# Altium schematic sheet Sheet2.SchDoc
size 420 x 297 mm; SheetNumber: 1; SheetTotal: 1
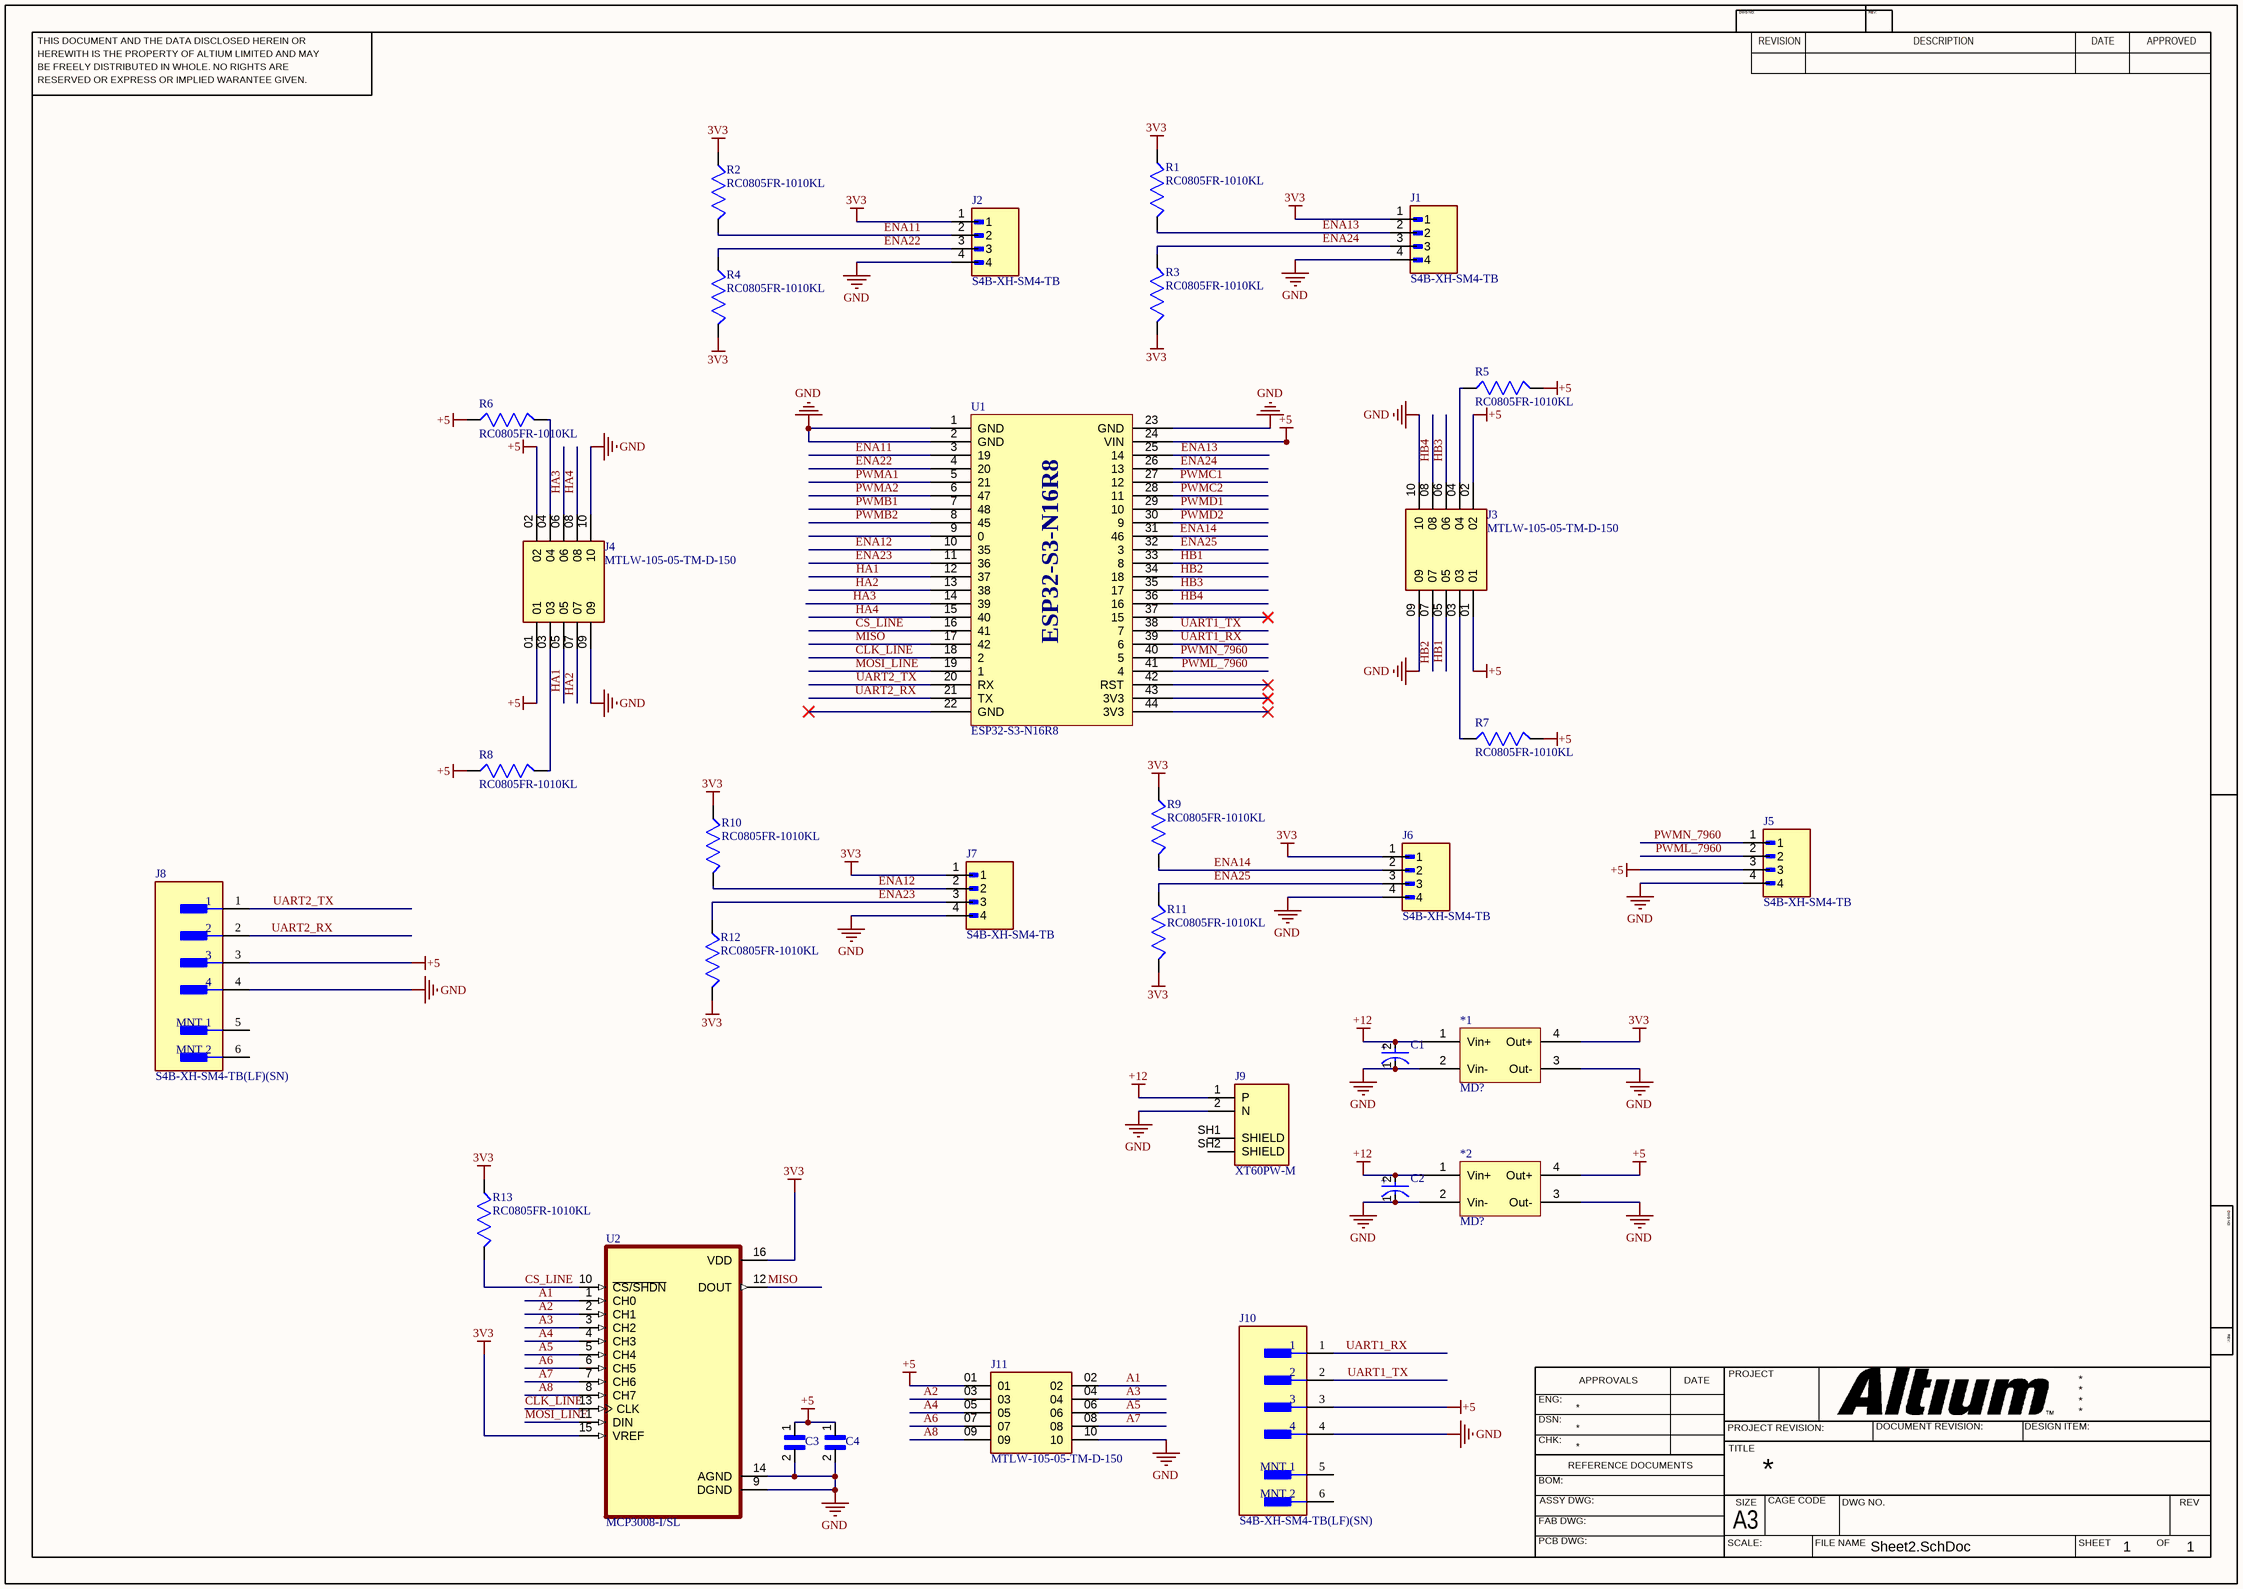
[diagram p0: Sheet2.SchDoc]

## Parts
*1  MD?  [MP1584]
*2  MD?  [MP1584]
C1  100SXV15MX  [FP-OS-CON-SMT-F8-MFG]  (value not drawn)
C2  100SXV15MX  [FP-OS-CON-SMT-F8-MFG]  (value not drawn)
C3  F951C106MPAAQ2  [CAPC2012X140N]  (value not drawn)
C4  F951C106MPAAQ2  [CAPC2012X140N]  (value not drawn)
J1  S4B-XH-SM4-TB  [JST_S4B-XH-SM4-TB]
J2  S4B-XH-SM4-TB  [JST_S4B-XH-SM4-TB]
J3  MTLW-105-05-TM-D-150  [SAMTEC_MTLW-105-05-TM-D-150]
J4  MTLW-105-05-TM-D-150  [SAMTEC_MTLW-105-05-TM-D-150]
J5  S4B-XH-SM4-TB  [JST_S4B-XH-SM4-TB]
J6  S4B-XH-SM4-TB  [JST_S4B-XH-SM4-TB]
J7  S4B-XH-SM4-TB  [JST_S4B-XH-SM4-TB]
J8  S4B-XH-SM4-TB(LF)(SN)  [FP-S4B-XH-SM4-TB_LF_SN-MFG]
J9  XT60PW-M  [AMASS_XT60PW-M]
J10  S4B-XH-SM4-TB(LF)(SN)  [FP-S4B-XH-SM4-TB_LF_SN-MFG]
J11  MTLW-105-05-TM-D-150  [SAMTEC_MTLW-105-05-TM-D-150]
R1  RC0805FR-1010KL  [RESC2012X60N]
R2  RC0805FR-1010KL  [RESC2012X60N]
R3  RC0805FR-1010KL  [RESC2012X60N]
R4  RC0805FR-1010KL  [RESC2012X60N]
R5  RC0805FR-1010KL  [RESC2012X60N]
R6  RC0805FR-1010KL  [RESC2012X60N]
R7  RC0805FR-1010KL  [RESC2012X60N]
R8  RC0805FR-1010KL  [RESC2012X60N]
R9  RC0805FR-1010KL  [RESC2012X60N]
R10  RC0805FR-1010KL  [RESC2012X60N]
R11  RC0805FR-1010KL  [RESC2012X60N]
R12  RC0805FR-1010KL  [RESC2012X60N]
R13  RC0805FR-1010KL  [RESC2012X60N]
U1  ESP32-S3-N16R8  [DIP44]
U2  MCP3008-I/SL  [SOIC127P600X175-16N]

## Nets
3V3: *1.4(Out+) J1.1 J2.1 J6.1 J7.1 R1.2 R2.2 R3.1 R4.1 R9.2 R10.2 R11.1 R12.1 R13.2 U2.15(VREF) U2.16(VDD)
+5: *2.4(Out+) C3.1 C4.1 J3.01 J3.02 J4.01 J4.02 J5.3 J8.3 J10.3 J11.01 R5.2 R6.2 R7.2 R8.2 U1.24(VIN)
+12: *1.1(Vin+) *2.1(Vin+) C1.2(A) C2.2(A) J9.1(P)
GND: *1.2(Vin-) *1.3(Out-) *2.2(Vin-) *2.3(Out-) C1.1(C) C2.1(C) C3.2 C4.2 J1.4 J2.4 J3.09 J3.10 J4.09 J4.10 J5.4 J6.4 J7.4 J8.4 J9.2(N) J10.4 J11.10 U1.1(GND) U1.2(GND) U1.23(GND) U2.9(DGND) U2.14(AGND)
A1: J11.02 U2.1(CH0)
A2: J11.03 U2.2(CH1)
A3: J11.04 U2.3(CH2)
A4: J11.05 U2.4(CH3)
A5: J11.06 U2.5(CH4)
A6: J11.07 U2.6(CH5)
A7: J11.08 U2.7(CH6)
A8: J11.09 U2.8(CH7)
CLK_LINE: U1.18(2) U2.13(CLK)
CS_LINE: R13.1 U1.16(41) U2.10(~{CS/SHDN})
ENA11: J2.2 R2.1 U1.3(19)
ENA12: J7.2 R10.1 U1.10(35)
ENA13: J1.2 R1.1 U1.25(14)
ENA14: J6.2 R9.1 U1.31(46)
ENA22: J2.3 R4.2 U1.4(20)
ENA23: J7.3 R12.2 U1.11(36)
ENA24: J1.3 R3.2 U1.26(13)
ENA25: J6.3 R11.2 U1.32(3)
HA1: J4.05 U1.12(37)
HA2: J4.07 U1.13(38)
HA3: J4.06 U1.14(39)
HA4: J4.08 U1.15(40)
HB1: J3.05 U1.33(8)
HB2: J3.07 U1.34(18)
HB3: J3.06 U1.35(17)
HB4: J3.08 U1.36(16)
MISO: U1.17(42) U2.12(DOUT)
MOSI_LINE: U1.19(1) U2.11(DIN)
PWMA1: U1.5(21)
PWMA2: U1.6(47)
PWMB1: U1.7(48)
PWMB2: U1.8(45)
PWMC1: U1.27(12)
PWMC2: U1.28(11)
PWMD1: U1.29(10)
PWMD2: U1.30(9)
PWML_7960: J5.2 U1.41(4)
PWMN_7960: J5.1 U1.40(5)
UART1_RX: J10.1 U1.39(6)
UART1_TX: J10.2 U1.38(7)
UART2_RX: J8.2 U1.21(TX)
UART2_TX: J8.1 U1.20(RX)
NetJ3_03: J3.03 R7.1
NetJ3_04: J3.04 R5.1
NetJ4_03: J4.03 R8.1
NetJ4_04: J4.04 R6.1

Not connected (* = marked no-connect by the designer): J8 5(MNT_1) 6(MNT_2); J9 SH1(SHIELD) SH2(SHIELD); J10 5(MNT_1) 6(MNT_2); U1 9(0) 22(GND)* 37(15)* 42(RST)* 43(3V3)* 44(3V3)*

## Notes on the sheet
- THIS DOCUMENT AND THE DATA DISCLOSED HEREIN OR
- HEREWITH IS THE PROPERTY OF ALTIUM LIMITED AND MAY
- DWG NO:
- REVISION
- REV:
- DESCRIPTION
- DATE
- APPROVED
- BE FREELY DISTRIBUTED IN WHOLE. NO RIGHTS ARE
- RESERVED OR EXPRESS OR IMPLIED WARANTEE GIVEN.
- ENG:
- APPROVALS
- PROJECT
- DSN:
- CHK:
- REFERENCE DOCUMENTS
- PROJECT REVISION:
- TITLE
- DOCUMENT REVISION:
- DESIGN ITEM:
- BOM:
- FAB DWG:
- PCB DWG:
- ASSY DWG:
- SCALE:
- A3
- SIZE
- CAGE CODE
- FILE NAME
- DWG NO.
- SHEET
- OF
- REV
- (in symbol CMP-05428-000606-1) +

## Library data of the parts
*1 *2 = MP1584
C1 C2 = CMP-05428-000606-1: Conductive Polymer Aluminum Solid Capacitors (OS-CON) 15uF ±20% 100V RADIAL SMT 10x7.9mm; ESR (Equivalent Series Resistance): 60mR; Life (Hours): 1000Hour; Series: OS-CON™, SXV; Capacitance: 15uF; Tolerance: 20%; Voltage Rating: 100V; Min Operating Temperature: -55°C; Packaging: Cut Tape; Mount: Surface Mount; Max Operating Temperature: 125°C; Case/Package: Radial
C3 C4 = F951C106MPAAQ2: 10ÂµF Conformal Coated Tantalum Capacitors 16V 0805 (2012 Metric) 4Ohm; MF: AVX; Package: 0805 AVX; Digi-Key_Part_Number: 478-8456-1-ND; Check_prices: https://www.snapeda.com/parts/F951C106MPAAQ2/AVX%20/%20Kyocera/view-part/1683022/?ref=eda; MP: F951C106MPAAQ2; SnapEDA_Link: https://www.snapeda.com/parts/F951C106MPAAQ2/AVX%20/%20Kyocera/view-part/1683022/?ref=snap; Value: *
J1 J2 J5-J7 = S4B-XH-SM4-TB: Connector Header Surface Mount, Right Angle 4 position 0.098 (2.50mm); MF: JST Sales; MP: S4B/XH/SM4/TB; SnapEDA_Link: https://www.snapeda.com/parts/S4B/XH/SM4/TB/JST/view-part/?ref=snap; Package: None; Value: *; Check_prices: https://www.snapeda.com/parts/S4B/XH/SM4/TB/JST/view-part/?ref=eda
J8 J10 = CMP-17439-000072-1: CONN HEADER SMD R/A 4POS 2.5MM; Number of Positions: 4; Max Current Rating: 3A; Max Voltage Rating (AC): 250V; Connector Type: Male Pin; Contact Resistance: 20mR; Gender: Male; Pitch: 0.098inch; Max Operating Temperature: 85°C; Contact Plating: Tin; Housing Material: Polyamide; Housing Color: Beige; Depth: 10mm; Series: XH; Package Quantity: 1; Length: 15mm; Contact Material: Copper Alloy; Min Operating Temperature: -25°C; REACH SVHC: No SVHC; Orientation: Right Angle; Number of Rows: 1; Contact Type: Male Pin; Color: Natural; Lead Free: Lead Free; Termination: Solder; Mount: Surface Mount; Number of Contacts: 4; Packaging: Tape and Reel
J9 = XT60PW-M: Socket, DC supply, male, PIN: 2; MF: AMASS; SnapEDA_Link: https://www.snapeda.com/parts/XT60PW-M/AMASS/view-part/?ref=snap; Package: Package; Value: *; MP: XT60PW-M; Check_prices: https://www.snapeda.com/parts/XT60PW-M/AMASS/view-part/?ref=eda
R1-R13 = RC0805FR-1010KL: RES, THICK FILM, 10K, 1%, 0.125W, 0805;; RES, THICK FILM, 10K, 1%, 0.125W, 0805; Resistance:10kohm; Resistance Tolerance:Â± 1%; Power Rating:125mW; Resistor Case Style:0805 ^2012 Metric]; Resistor Technology:Thick Film; Resistor Type:General Purpose; Prod; MF: Yageo Corporation; MP: RC0805FR1010KL; SnapEDA_Link: https://www.snapeda.com/parts/RC0805FR1010KL/Yageo/view-part/?ref=snap; Package: 0805-2 YAGEO; Value: *; Check_prices: https://www.snapeda.com/parts/RC0805FR1010KL/Yageo/view-part/?ref=eda
U2 = MCP3008-I/SL: 10 Bit Analog to Digital Converter 4, 8 Input 1 SAR 16-SOIC; MF: Microchip; Value: *; Price: None; Package: SOIC-16 Microchip; Check_prices: https://www.snapeda.com/parts/MCP3008-I/SL/Microchip/view-part/?ref=eda; Availability: In Stock; SnapEDA_Link: https://www.snapeda.com/parts/MCP3008-I/SL/Microchip/view-part/?ref=snap; MP: MCP3008-I/SL; Purchase-URL: https://pricing.snapeda.com/search/part/MCP3008-I/SL/?ref=eda
J3 J4 J11 = MTLW-105-05-TM-D-150: Value: *; Package: None; Price: None; MP: MTLW-105-05-TM-D-150; Availability: Unavailable